# EAGLE schematic tC-mcu-breakout-rev1 (EAGLE 7.2.0)
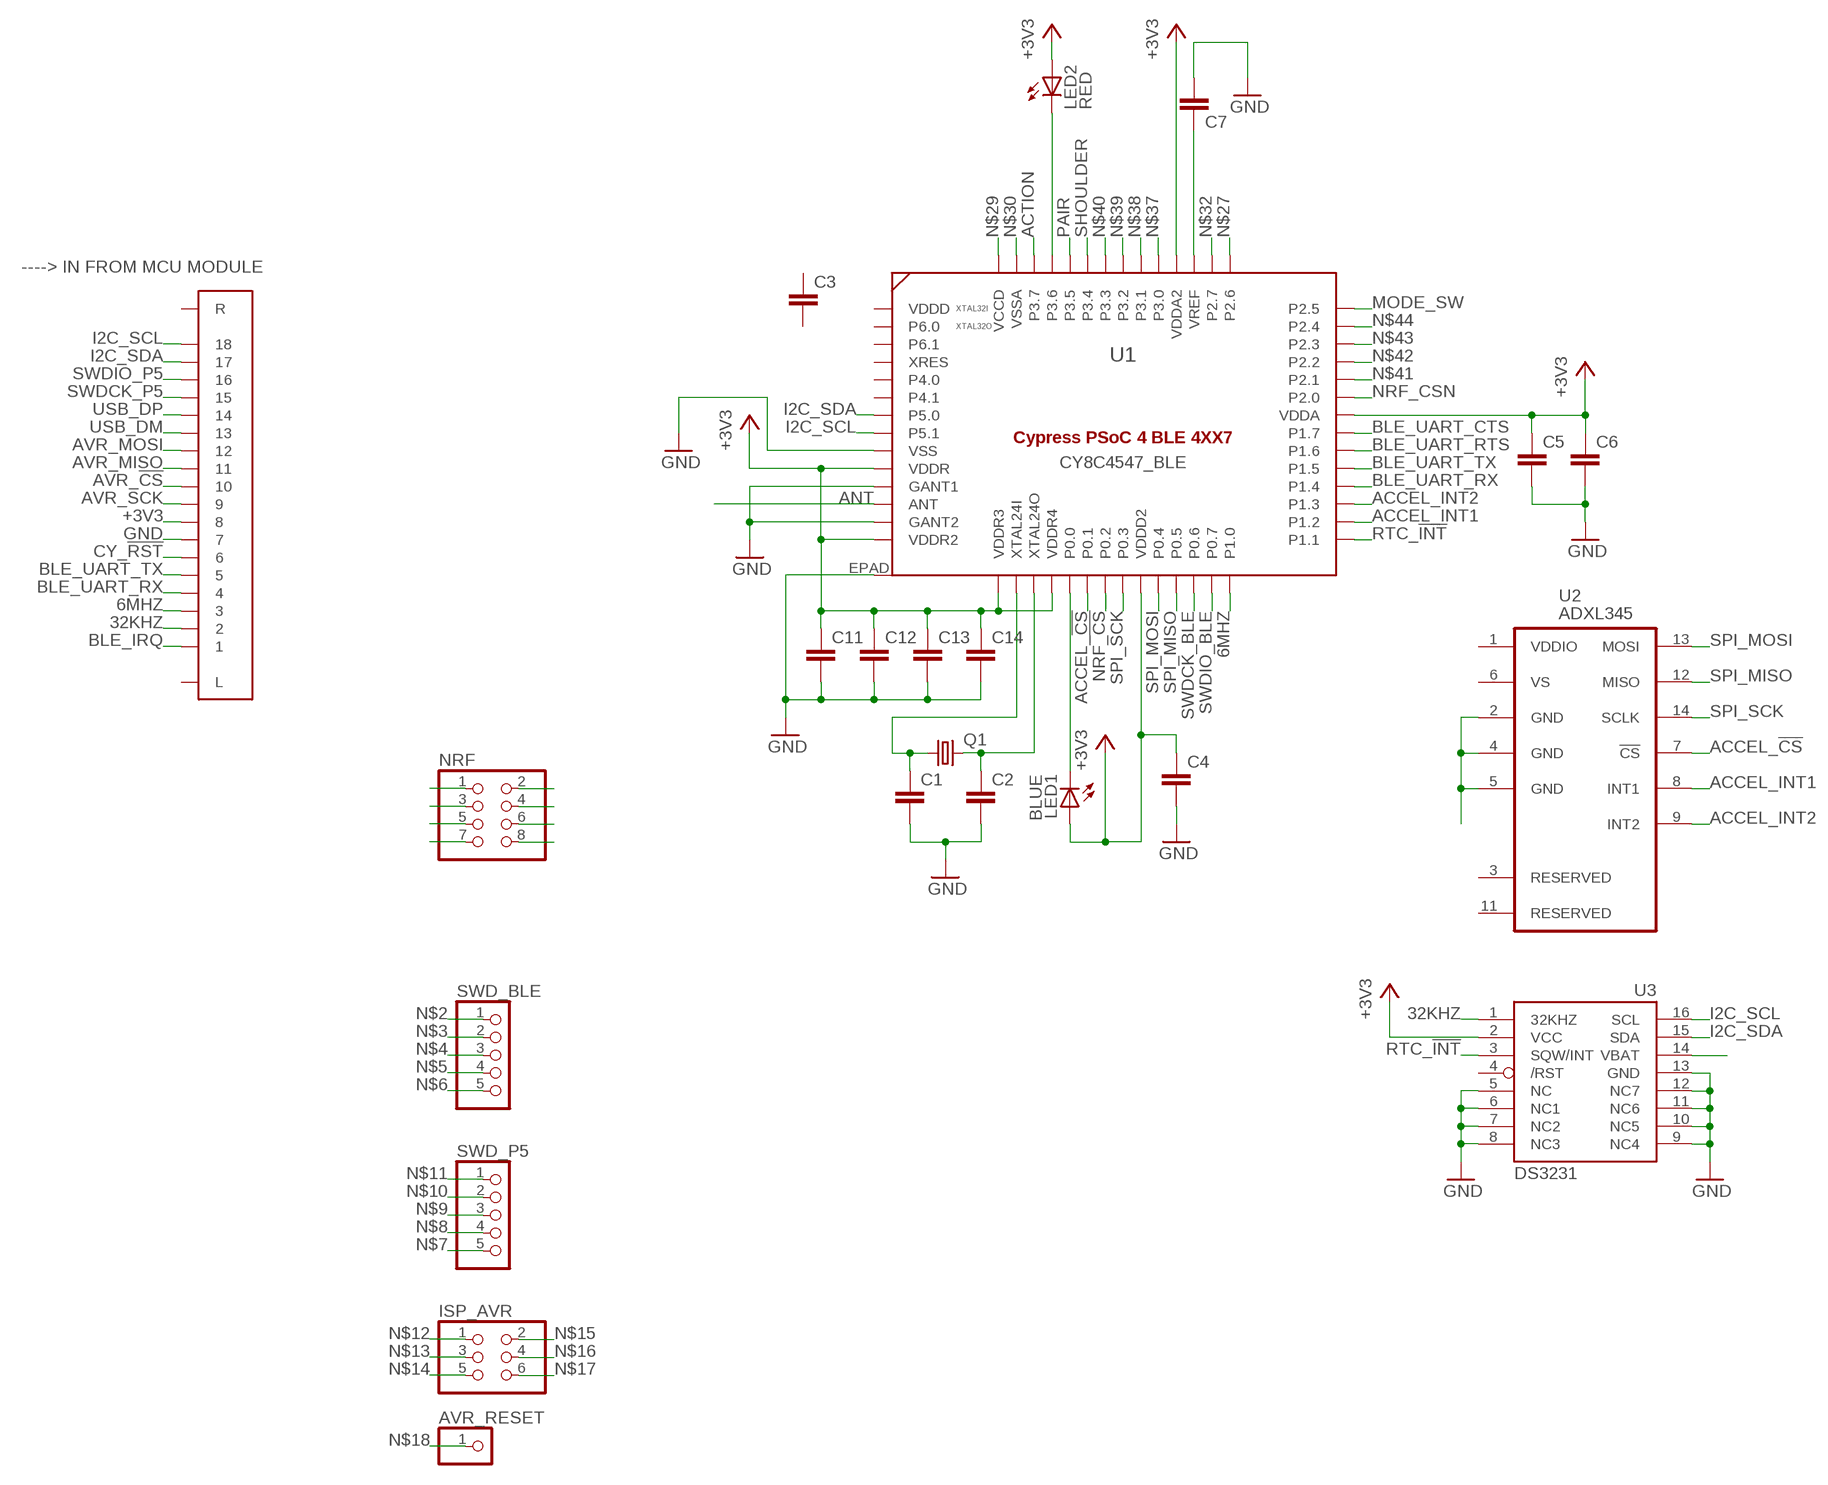
[diagram p0: schematic, sheet 1]

## Parts
AVR_RESET  PINHD-1X1  [1X01]
C1  C-EUC0402K  [C0402K]
C2  C-EUC0402K  [C0402K]
C3  C-EUC0402K  [C0402K]
C4  C-EUC0402K  [C0402K]
C5  C-EUC0402K  [C0402K]
C6  C-EUC0402K  [C0402K]
C7  C-EUC0402K  [C0402K]
C11  C-EUC0402K  [C0402K]
C12  C-EUC0402K  [C0402K]
C13  C-EUC0402K  [C0402K]
C14  C-EUC0402K  [C0402K]
CN1  FPC_CONN_18PIN_0.5MM_SMT  [FPC_CONN_18PIN_0.5MM_SMT]
ISP_AVR  PINHD-2X3  [2X03]
LED1  BLUE  LEDCHIPLED_0603  [CHIPLED_0603]
LED2  RED  LEDCHIPLED_0603  [CHIPLED_0603]
NRF  PINHD-2X4  [2X04]
Q1  CRYSTALHC49UP  [HC49UP]
SWD_BLE  PINHD-1X5  [1X05]
SWD_P5  PINHD-1X5  [1X05]
U1  CY8C4547_BLE  CY8C4XX7_BLE-56  [QFN56]
U2  ADXL345  [LGA14]
U3  DS3231/SO  [SO16W]

## Nets
6MHZ: CN1.3 U1.28(P1.0)
32KHZ: CN1.2 U3.1(32KHZ)
+3V3: C4.1 C5.1 C6.1 C11.1 C12.1 C13.1 C14.1 CN1.8 LED1.A LED2.A U1.10(VDDR) U1.14(VDDR2) U1.15(VDDR3) U1.18(VDDR4) U1.23(VDDD2) U1.36(VDDA) U1.46(VDDA2) U3.2(VCC)
ACCEL_!CS: U1.20(P0.1) U2.7(!CS)
ACCEL_INT1: U1.30(P1.2) U2.8(INT1)
ACCEL_INT2: U1.31(P1.3) U2.9(INT2)
ACTION: U1.54(P3.7)
ANT: U1.12(ANT)
AVR_!CS: CN1.10
AVR_MISO: CN1.11
AVR_MOSI: CN1.12
AVR_SCK: CN1.9
BLE_IRQ: CN1.1
BLE_UART_CTS: U1.35(P1.7)
BLE_UART_RTS: U1.34(P1.6)
BLE_UART_RX: CN1.4 U1.32(P1.4)
BLE_UART_TX: CN1.5 U1.33(P1.5)
CY_!RST: CN1.6
GND: C1.2 C2.2 C4.2 C5.2 C6.2 C7.2 C11.2 C12.2 C13.2 C14.2 CN1.7 U1.9(VSS) U1.11(GANT1) U1.13(GANT2) U1.EPAD U3.5(NC) U3.6(NC1) U3.7(NC2) U3.8(NC3) U3.9(NC4) U3.10(NC5) U3.11(NC6) U3.12(NC7) U3.13(GND)
I2C_SCL: CN1.18 U1.8(P5.1) U3.16(SCL)
I2C_SDA: CN1.17 U1.7(P5.0) U3.15(SDA)
LED0: LED1.C U1.19(P0.0)
MODE_SW: U1.42(P2.5)
N$1: U2.2(GND) U2.4(GND) U2.5(GND)
N$2: SWD_BLE.1
N$3: SWD_BLE.2
N$4: SWD_BLE.3
N$5: SWD_BLE.4
N$6: SWD_BLE.5
N$7: SWD_P5.5
N$8: SWD_P5.4
N$9: SWD_P5.3
N$10: SWD_P5.2
N$11: SWD_P5.1
N$12: ISP_AVR.1
N$13: ISP_AVR.3
N$14: ISP_AVR.5
N$15: ISP_AVR.2
N$16: ISP_AVR.4
N$17: ISP_AVR.6
N$18: AVR_RESET.1
N$19: NRF.1
N$20: NRF.3
N$21: NRF.5
N$22: NRF.7
N$23: NRF.2
N$24: NRF.4
N$25: NRF.6
N$26: NRF.8
N$27: U1.43(P2.6)
N$28: LED2.C U1.53(P3.6)
N$29: U1.56(VCCD)
N$30: U1.55(VSSA)
N$32: U1.44(P2.7)
N$33: C1.1 Q1.1 U1.16(XTAL24I)
N$34: C2.1 Q1.2 U1.17(XTAL24O)
N$35: C7.1 U1.45(VREF)
N$37: U1.47(P3.0)
N$38: U1.48(P3.1)
N$39: U1.49(P3.2)
N$40: U1.50(P3.3)
N$41: U1.38(P2.1)
N$42: U1.39(P2.2)
N$43: U1.40(P2.3)
N$44: U1.41(P2.4)
NRF_!CS: U1.21(P0.2)
NRF_CSN: U1.37(P2.0)
PAIR: U1.52(P3.5)
RTC_!INT: U1.29(P1.1) U3.3(SQW/INT)
RTC_VBAT: U3.14(VBAT)
SHOULDER: U1.51(P3.4)
SPI_MISO: U1.25(P0.5) U2.12(MISO)
SPI_MOSI: U1.24(P0.4) U2.13(MOSI)
SPI_SCK: U1.22(P0.3) U2.14(SCLK)
SWDCK_BLE: U1.26(P0.6)
SWDCK_P5: CN1.15
SWDIO_BLE: U1.27(P0.7)
SWDIO_P5: CN1.16
USB_DM: CN1.13
USB_DP: CN1.14
Unconnected: C3.1 C3.2 CN1.GL(L) CN1.GR(R) U1.1(VDDD) U1.2(P6.0) U1.3(P6.1) U1.4(XRES) U1.5(P4.0) U1.6(P4.1) U2.3(RESERVED) U2.10(NC) U2.11(RESERVED) U3.4(/RST)

## Notes on the sheet
- ----> IN FROM MCU MODULE

## Power pins joined to a net without a drawn wire
VDDIO: U2.1(VDDIO)
VS: U2.6(VS)

## Library data of the parts
AVR_RESET = pinhead:PINHD-1X1: PIN HEADER
C1-C7 C11-C14 = rcl:C-EU: CAPACITOR, European symbol
CN1 = _dc801:FPC_CONN_18PIN
ISP_AVR = pinhead:PINHD-2X3: PIN HEADER
LED1 LED2 = led:LED: LED OSRAM: - CHIPLED LG R971, LG N971, LY N971, LG Q971, LY Q971, LO R971, LY R971 LH N974, LH R974 LS Q976, LO Q976, LY Q976 LO Q996 - Hyper CHIPLED LW Q18S LB Q993, LB Q99A, LB R99A - SideLED LS A670, LO A670, LY A670, LG A670, LP A670 LB A673, LV A673, LT A673, LW A673 LH A674 LY A675 LS A676, LA A676, LO A676, LY A676, LW A676 LS A679, LY A679, LG A679 - Hyper Micro SIDELED® LS Y876, LA Y876, LO Y876, LY Y876 LT Y87S - SmartLED LW L88C, LW L88S LB L89C, LB L89S, LG L890 LS L89K, LO L89K, LY L89K LS L896, LA L896, LO L896, LY L896 - TOPLED LS T670, LO T670, LY T670, LG T670, LP T670 LSG T670, LSP T670, LSY T670, LOP T670, LYG T670 LG T671, LOG T671, LSG T671 LB T673, LV T673, LT T673, LW T673 LH T674 LS T676, LA T676, LO T676, LY T676, LB T676, LH T676, LSB T676, LW T676 LB T67C, LV T67C, LT T67C, LS T67K, LO T67K, LY T67K, LW E67C LS E67B, LA E67B, LO E67B, LY E67B, LB E67C, LV E67C, LT E67C LW T67C LS T679, LY T679, LG T679 LS T770, LO T770, LY T770, LG T770, LP T770 LB T773, LV T773, LT T773, LW T773 LH T774 LS E675, LA E675, LY E675, LS T675 LS T776, LA T776, LO T776, LY T776, LB T776 LHGB T686 LT T68C, LB T68C - Hyper Mini TOPLED® LB M676 - Mini TOPLED Santana® LG M470 LS M47K, LO M47K, LY M47K Source: http://www.osram.convergy.de LUXEON: - LUMILED® LXK2-PW12-R00, LXK2-PW12-S00, LXK2-PW14-U00, LXK2-PW14-V00 LXK2-PM12-R00, LXK2-PM12-S00, LXK2-PM14-U00 LXK2-PE12-Q00, LXK2-PE12-R00, LXK2-PE12-S00, LXK2-PE14-T00, LXK2-PE14-U00 LXK2-PB12-K00, LXK2-PB12-L00, LXK2-PB12-M00, LXK2-PB14-N00, LXK2-PB14-P00, LXK2-PB14-Q00 LXK2-PR12-L00, LXK2-PR12-M00, LXK2-PR14-Q00, LXK2-PR14-R00 LXK2-PD12-Q00, LXK2-PD12-R00, LXK2-PD12-S00 LXK2-PH12-R00, LXK2-PH12-S00 LXK2-PL12-P00, LXK2-PL12-Q00, LXK2-PL12-R00 Source: www.luxeon.com KINGBRIGHT: KA-3528ASYC Source: www.kingbright.com
NRF = pinhead:PINHD-2X4: PIN HEADER
Q1 = crystal:CRYSTAL: CRYSTAL; OC_FARNELL: unknown; OC_NEWARK: unknown
SWD_BLE SWD_P5 = pinhead:PINHD-1X5: PIN HEADER
U1 = PatternAgents-Cypress:CY8C4XX7_BLE-56
U2 = adxl345:ADXL345: 3-Axis, ±2 g/±4 g/±8 g/±16 g Digital Accelerometer
U3 = adafruit:DS3231